# EAGLE design NFC_BusinessCard (EAGLE 8.3.1)
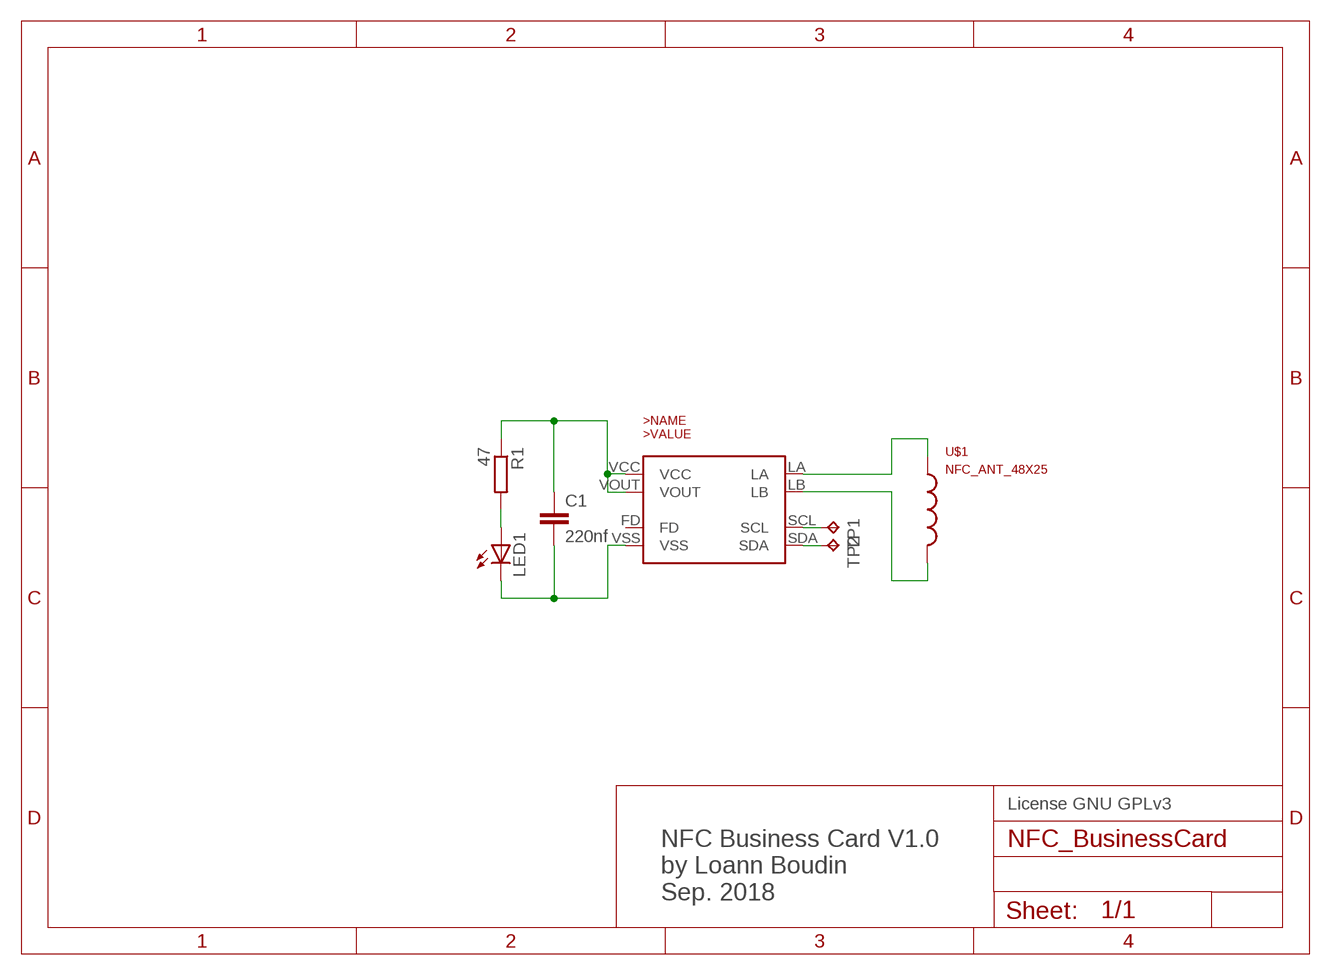
[diagram p0: schematic, sheet 1]

## Parts
C1  220nf  C-EUC0603  [C0603]
LED1  LEDSML0805  [SML0805]
NT3H1101  NT3H1101  [XQFN8]
R1  47  R-EU_R0603  [R0603]
TP1  TPTP06R  [TP06R]
TP2  TPTP06R  [TP06R]
U$1  NFC_ANT_48X25  [NFC_ANT_48X25]

## Nets
N$1: NT3H1101.LA U$1.A
N$2: NT3H1101.LB U$1.B U$1.P$3(B)
N$3: C1.1 NT3H1101.VCC NT3H1101.VOUT R1.1
N$4: LED1.A R1.2
N$5: NT3H1101.SDA TP2.TP
N$6: C1.2 LED1.C NT3H1101.VSS
N$7: NT3H1101.SCL TP1.TP
Unconnected: NT3H1101.FD

## Notes on the sheet
- License GNU GPLv3
- NFC Business Card V1.0
  by Loann Boudin
  Sep. 2018

## Library data of the parts
C1 = resistor:C-EU: CAPACITOR, European symbol
LED1 = led:LED: LED OSRAM: - CHIPLED LG R971, LG N971, LY N971, LG Q971, LY Q971, LO R971, LY R971 LH N974, LH R974 LS Q976, LO Q976, LY Q976 LO Q996 - Hyper CHIPLED LW Q18S LB Q993, LB Q99A, LB R99A - SideLED LS A670, LO A670, LY A670, LG A670, LP A670 LB A673, LV A673, LT A673, LW A673 LH A674 LY A675 LS A676, LA A676, LO A676, LY A676, LW A676 LS A679, LY A679, LG A679 - Hyper Micro SIDELED® LS Y876, LA Y876, LO Y876, LY Y876 LT Y87S - SmartLED LW L88C, LW L88S LB L89C, LB L89S, LG L890 LS L89K, LO L89K, LY L89K LS L896, LA L896, LO L896, LY L896 - TOPLED LS T670, LO T670, LY T670, LG T670, LP T670 LSG T670, LSP T670, LSY T670, LOP T670, LYG T670 LG T671, LOG T671, LSG T671 LB T673, LV T673, LT T673, LW T673 LH T674 LS T676, LA T676, LO T676, LY T676, LB T676, LH T676, LSB T676, LW T676 LB T67C, LV T67C, LT T67C, LS T67K, LO T67K, LY T67K, LW E67C LS E67B, LA E67B, LO E67B, LY E67B, LB E67C, LV E67C, LT E67C LW T67C LS T679, LY T679, LG T679 LS T770, LO T770, LY T770, LG T770, LP T770 LB T773, LV T773, LT T773, LW T773 LH T774 LS E675, LA E675, LY E675, LS T675 LS T776, LA T776, LO T776, LY T776, LB T776 LHGB T686 LT T68C, LB T68C - Hyper Mini TOPLED® LB M676 - Mini TOPLED Santana® LG M470 LS M47K, LO M47K, LY M47K Source: http://www.osram.convergy.de LUXEON: - LUMILED® LXK2-PW12-R00, LXK2-PW12-S00, LXK2-PW14-U00, LXK2-PW14-V00 LXK2-PM12-R00, LXK2-PM12-S00, LXK2-PM14-U00 LXK2-PE12-Q00, LXK2-PE12-R00, LXK2-PE12-S00, LXK2-PE14-T00, LXK2-PE14-U00 LXK2-PB12-K00, LXK2-PB12-L00, LXK2-PB12-M00, LXK2-PB14-N00, LXK2-PB14-P00, LXK2-PB14-Q00 LXK2-PR12-L00, LXK2-PR12-M00, LXK2-PR14-Q00, LXK2-PR14-R00 LXK2-PD12-Q00, LXK2-PD12-R00, LXK2-PD12-S00 LXK2-PH12-R00, LXK2-PH12-S00 LXK2-PL12-P00, LXK2-PL12-Q00, LXK2-PL12-R00 Source: www.luxeon.com KINGBRIGHT: KA-3528ASYC Source: www.kingbright.com
NT3H1101 = business_card:NT3H1101
R1 = resistor:R-EU_: RESISTOR, European symbol
TP1 TP2 = testpad:TP: Test pad
U$1 = business_card:NFC_ANT_48X25

## Board
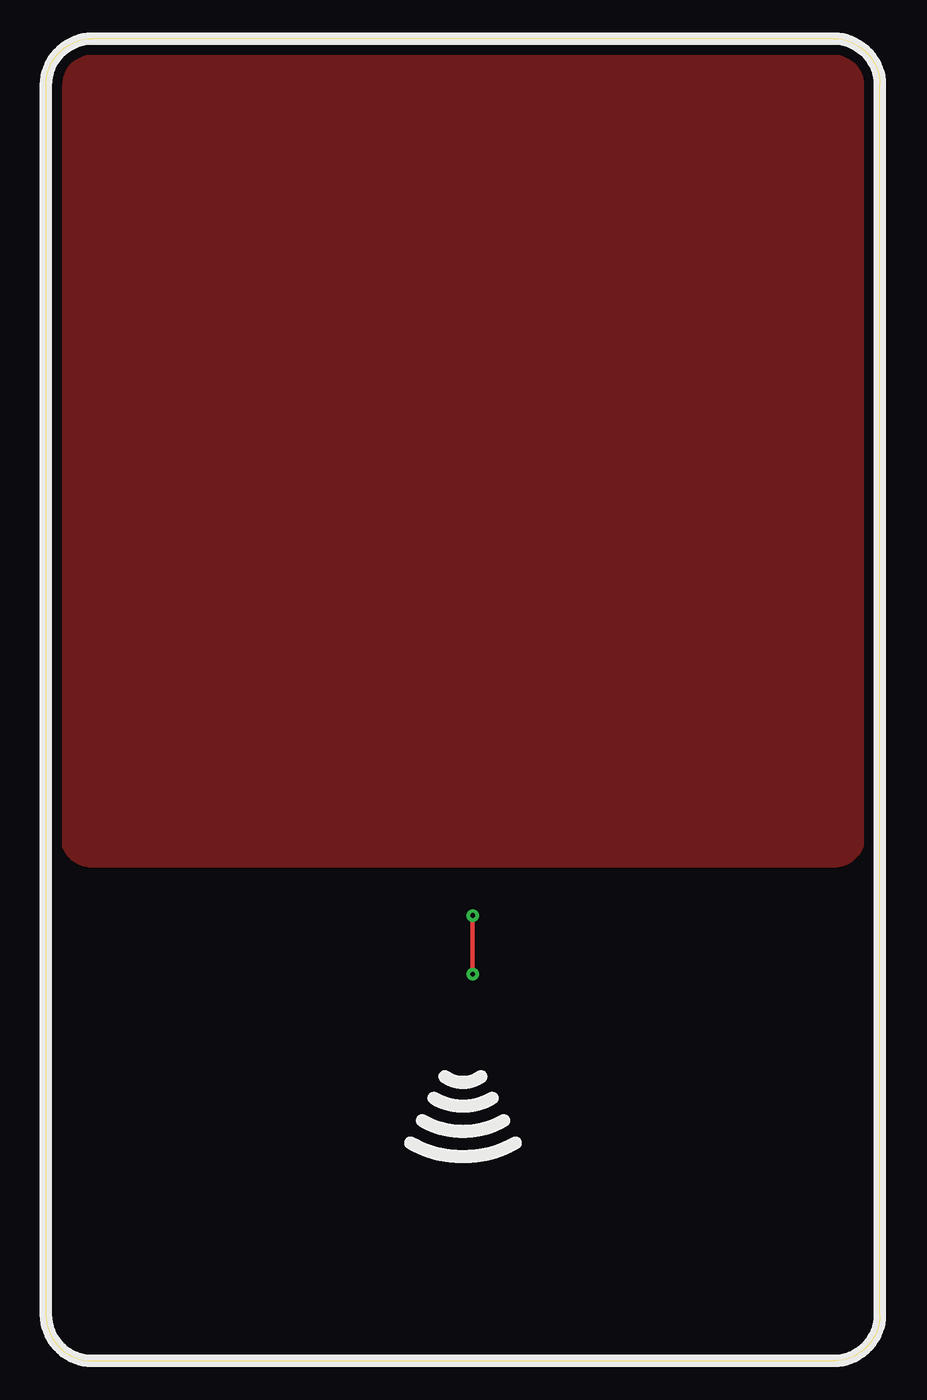
[diagram p1: board, top side]
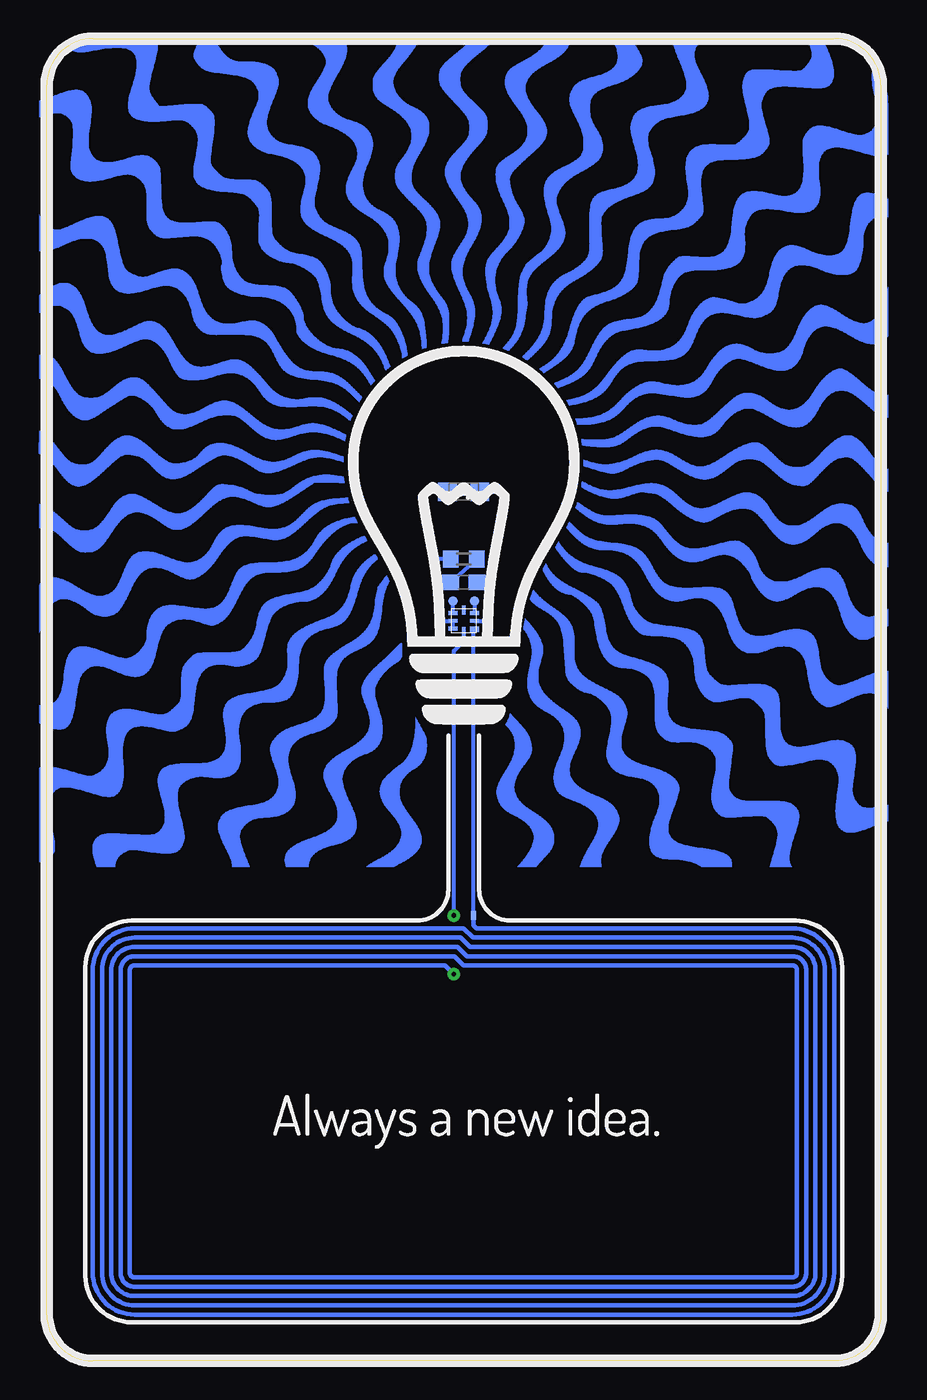
[diagram p2: board, bottom side, seen from below]

Size 54 x 85.6 mm. Coordinates in mm from the lower left corner, seen from the top.
Outline: 3,0 51,0 arc90 54,3 54,82.6 arc90 51,85.6 3,85.6 arc90 0,82.6 0,3 arc90 3,0
Copper layers (1*16): Top 0.035mm / dielectric 1.5mm / Bottom 0.035mm
Design rules "default": minimum track width 6mil, minimum drill 0.35mm, track to track 6mil, track to pad 6mil, pad to pad 6mil, via to via 6mil, smd to smd 6mil, copper to edge 40mil, drill to drill 6mil, minimum pad ring 10mil, minimum via ring 8mil, stop-mask expansion 4mil, vias tented up to drill 0mil, thermal gap 10mil

### Footprints (pad centres in the part's own frame; a part is rotated, then mirrored left to right if it is on the bottom)
C0603 = smd 1.1 x 1: 1 -0.85,0; 2 0.85,0
SML0805 = smd 1.2 x 1.2: A 1.05,0; C -1.05,0
XQFN8 = smd 0.25 x 0.6: FD 0,-0.7; LB 0,0.7 | smd 0.6 x 0.35: LA -0.7,0.55 | smd 0.6 x 0.25: SCL -0.7,-0.5; SDA 0.7,-0.5; VCC 0.7,0; VOUT 0.7,0.5; VSS -0.7,0
R0603 = smd 1 x 1.1: 1 -0.85,0; 2 0.85,0
TP06R = smd 0.6 x 0.6: TP 0,0
NFC_ANT_48X25 = smd 0.3 x 0.6 bottom: A -0.635,13.335 | drill 0.3 pad 0.61: B 0.635,13.335; P$3 0.635,9.525

### Placement (x,y rotation side)
C1  27,50.4 0 bottom
LED1  27,56.27 180 bottom
NT3H1101  27,47.91 180 bottom
R1  27,51.9 180 bottom
TP1  26.3,49.2 0 bottom
TP2  27.7,49.2 0 bottom
U$1  27,15.5 0 top

### Tracks (layer width: path | path; a pad name or v marks a point on that pad's centre or on a via)
N$1
  Bottom 0.254: U$1.A 26.36,47.3 NT3H1101.LA
N$2
  Bottom 0.25: NT3H1101.LB 27,46.6
  Bottom 0.254: U$1.B 27.64,45.97 27,46.6
N$3
  Bottom 0.25: R1.1 C1.1 28.7,50.4 28.55,47.91 NT3H1101.VCC NT3H1101.VOUT
N$4
  Bottom 0.25: LED1.A 28.7,56.3 29,56.6 29.66,55.9 28.95,51.9 28.19,51.9
  Bottom 0.254: R1.2 28.19,51.9
N$5
  Bottom 0.25: NT3H1101.SDA TP2.TP
N$6
  Bottom 0.25: LED1.C 25.3,56.3 25,56.6 24.35,55.91 25.3,50.4 | 25.3,50.4 C1.2 | NT3H1101.VSS 25.45,47.91 25.3,50.4
N$7
  Bottom 0.25: TP1.TP NT3H1101.SCL
N$9
  pour Top: 3,84.5 51,84.5 arc-90 53,82.5 53,34 arc-90 51,32 3,32 arc-90 1,34 1,82.5 arc-90
(copper drawn outside any net)
  shapes: Bottom area x21821